# Altium schematic sheet S04_Microcontroller.SchDoc
size A4
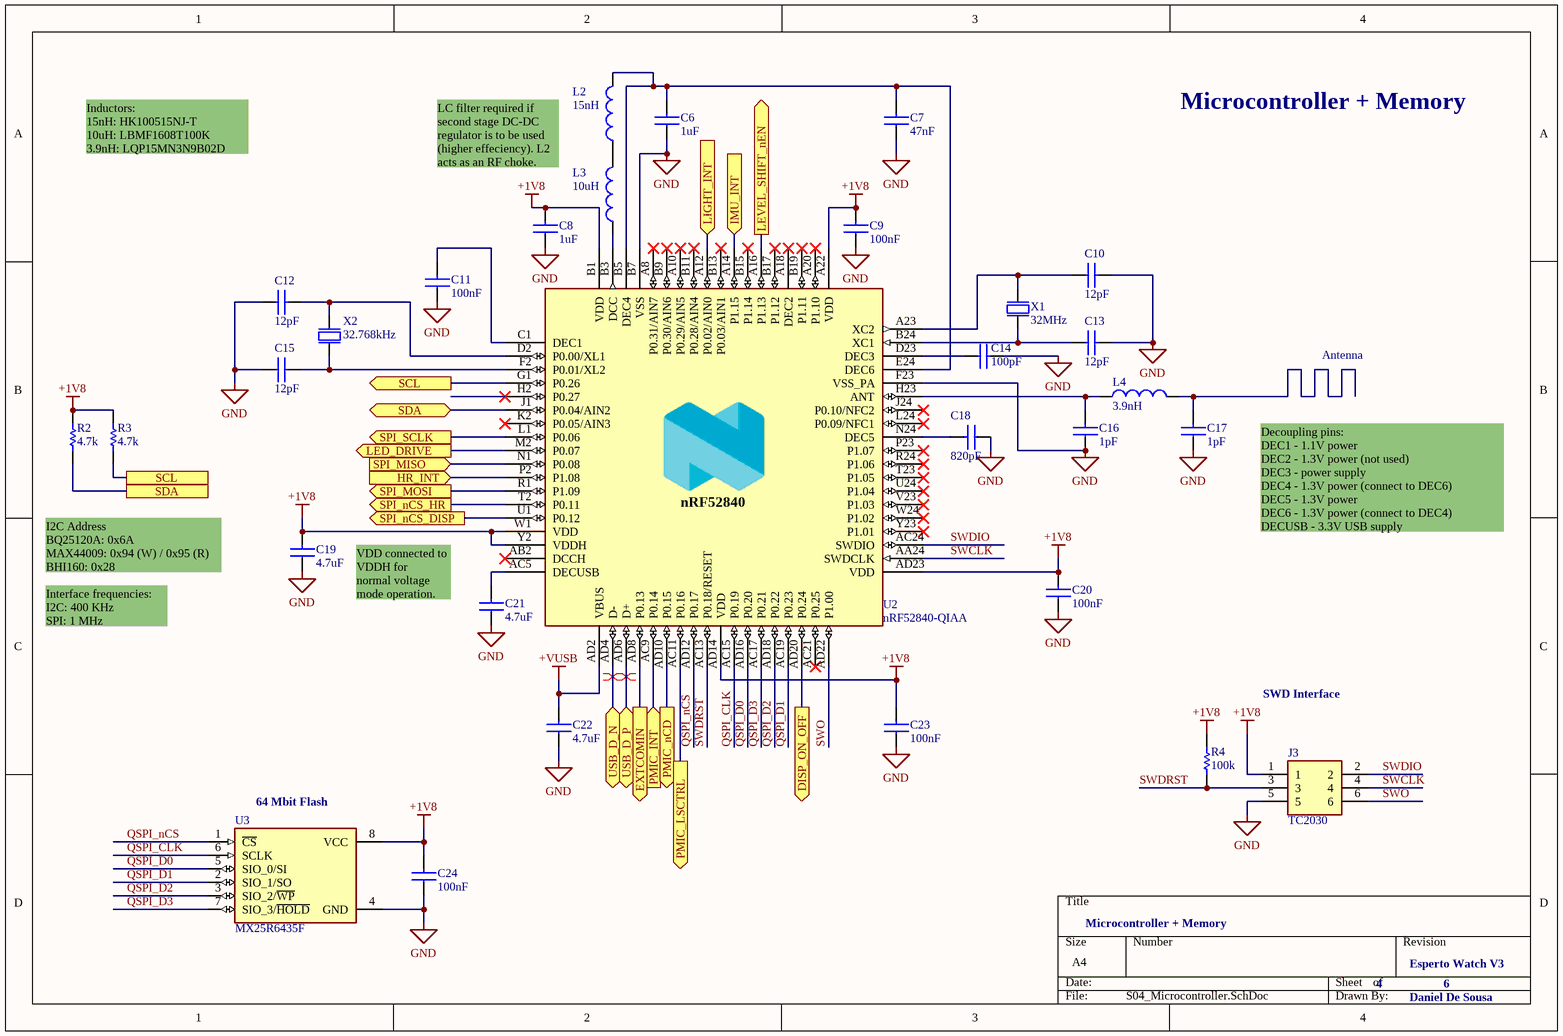
[diagram p0: S04_Microcontroller.SchDoc]

## Parts
C6  1uF  [CC_1005_0402_N]
C7  47nF  [CC_1005_0402_N]
C8  1uF  [CC_1005_0402_N]
C9  100nF  [CC_1005_0402_N]
C10  12pF  [CC_1005_0402_N]
C11  100nF  [CC_1005_0402_N]
C12  12pF  [CC_1005_0402_N]
C13  12pF  [CC_1005_0402_N]
C14  100pF  [CC_1005_0402_N]
C15  12pF  [CC_1005_0402_N]
C16  1pF  [CC_1005_0402_N]
C17  1pF  [CC_1005_0402_N]
C18  820pF  [CC_1005_0402_N]
C19  4.7uF  [CC_1005_0402_N]
C20  100nF  [CC_1005_0402_N]
C21  4.7uF  [CC_1005_0402_N]
C22  4.7uF  [CC_1005_0402_N]
C23  100nF  [CC_1005_0402_N]
C24  100nF  [CC_1005_0402_N]
J3  TC2030  [CONN_TC2030]  (no BOM)
L2  15nH  [RC_1005_0402_N]
L3  10uH  [IND_1608_0603_N]
L4  3.9nH  [RC_1005_0402_N]
R2  4.7k  [RC_1005_0402_N]
R3  4.7k  [RC_1005_0402_N]
R4  100k  [RC_1005_0402_N]
U2  nRF52840-QIAA  [nRF52840]
U3  MX25R6435F  [MX25R6435FZNIL0]
X1  32MHz  [XTAL_32M]
X2  32.768kHz  [XTAL_32K768]

## Ports
DISP_ON_OFF (out), EXTCOMIN (out), HR_INT (in), IMU_INT (in), LED_DRIVE (out), LEVEL_SHIFT_nEN (out), LIGHT_INT (in), PMIC_INT (in), PMIC_LSCTRL (out), PMIC_nCD (out), SCL, SCL (out), SDA, SDA (bidir), SPI_MISO (in), SPI_MOSI (out), SPI_nCS_DISP (out), SPI_nCS_HR (out), SPI_SCLK (out), USB_D_N (bidir), USB_D_P (bidir)

## Nets
+1V8: C8.2 C9.2 C19.2 C20.2 C23.2 C24.2 J3.1 R2.2 R3.2 R4.2 U2.A22(VDD) U2.AD14(VDD) U2.AD23(VDD) U2.B1(VDD) U2.W1(VDD) U2.Y2(VDDH) U3.8(VCC)
+VUSB: C22.2 U2.AD2(VBUS)
GND: C6.1 C7.1 C8.1 C9.1 C10.2 C11.1 C12.1 C13.2 C14.2 C15.1 C16.1 C17.1 C18.1 C19.1 C20.1 C21.1 C22.1 C23.1 C24.1 J3.5 U2.74(GND) U2.B7(VSS) U2.F23(VSS_PA) U3.4(GND) U3.9(GND) X1.2(GND) X1.4(GND)
DISP_ON_OFF: U2.AD20(P0.24) ; port DISP_ON_OFF
EXTCOMIN: U2.AD8(P0.13) ; port EXTCOMIN
HR_INT: U2.P2(P1.08) ; port HR_INT
IMU_INT: U2.A14(P1.15) ; port IMU_INT
LED_DRIVE: U2.M2(P0.07) ; port LED_DRIVE
LEVEL_SHIFT_nEN: U2.A16(P1.13) ; port LEVEL_SHIFT_nEN
LIGHT_INT: U2.A12(P0.02/AIN0) ; port LIGHT_INT
PMIC_INT: U2.AC9(P0.14) ; port PMIC_INT
PMIC_LSCTRL: U2.AC11(P0.16) ; port PMIC_LSCTRL
PMIC_nCD: U2.AD10(P0.15) ; port PMIC_nCD
QSPI_CLK: U2.AC15(P0.19) U3.6(SCLK)
QSPI_D0: U2.AD16(P0.20) U3.5(SIO_0/SI)
QSPI_D1: U2.AC19(P0.23) U3.2(SIO_1/SO)
QSPI_D2: U2.AD18(P0.22) U3.3(SIO_2/~{WP})
QSPI_D3: U2.AC17(P0.21) U3.7(SIO_3/~{HOLD})
QSPI_nCS: U2.AD12(P0.17) U3.1(~{CS})
SCL: R3.1 U2.G1(P0.26) ; port SCL
SDA: R2.1 U2.J1(P0.04/AIN2) ; port SDA
SPI_MISO: U2.N1(P0.08) ; port SPI_MISO
SPI_MOSI: U2.R1(P1.09) ; port SPI_MOSI
SPI_nCS_DISP: U2.U1(P0.12) ; port SPI_nCS_DISP
SPI_nCS_HR: U2.T2(P0.11) ; port SPI_nCS_HR
SPI_SCLK: U2.L1(P0.06) ; port SPI_SCLK
SWCLK: J3.4 U2.AA24(SWDCLK)
SWDIO: J3.2 U2.AC24(SWDIO)
SWDRST: J3.3 R4.1 U2.AC13(P0.18/RESET)
SWO: J3.6 U2.AD22(P1.00)
USB_D_N: U2.AD4(D-) ; port USB_D_N
USB_D_P: U2.AD6(D+) ; port USB_D_P
NetC6_2: C6.2 C7.2 L2.2 U2.B5(DEC4) U2.E24(DEC6)
NetC10_1: C10.1 U2.A23(XC2) X1.3(out)
NetC11_2: C11.2 U2.C1(DEC1)
NetC12_2: C12.2 U2.D2(P0.00/XL1) X2.2(out)
NetC13_1: C13.1 U2.B24(XC1) X1.1(inp)
NetC14_1: C14.1 U2.D23(DEC3)
NetC15_2: C15.2 U2.F2(P0.01/XL2) X2.1(inp)
NetC16_2: C16.2 L4.1 U2.H23(ANT)
NetC17_2: C17.2 L4.2
NetC18_2: C18.2 U2.N24(DEC5)
NetC21_2: C21.2 U2.AC5(DECUSB)
NetL2_1: L2.1 L3.2
NetL3_1: L3.1 U2.B3(DCC)

Not connected (* = marked no-connect by the designer): U2 A8(P0.31/AIN7)* A10(P0.29/AIN5)* A18(DEC2)* A20(P1.10)* AB2(DCCH)* AC21(P0.25)* B9(P0.30/AIN6)* B11(P0.28/AIN4)* B13(P0.03/AIN1)* B15(P1.14)* B17(P1.12)* B19(P1.11)* H2(P0.27)* J24(P0.10/NFC2)* K2(P0.05/AIN3)* L24(P0.09/NFC1)* P23(P1.07)* R24(P1.06)* T23(P1.05)* U24(P1.04)* V23(P1.03)* W24(P1.02)* Y23(P1.01)*

## Layout directives
differential pair: USB_D_N, USB_D_P

## Notes on the sheet
- Microcontroller + Memory
- Inductors:
  15nH: HK100515NJ-T
  10uH: LBMF1608T100K
  3.9nH: LQP15MN3N9B02D
- LC filter required if second stage DC-DC regulator is to be used (higher effeciency). L2 acts as an RF choke.
- Antenna
- I2C Address
  BQ25120A: 0x6A
  MAX44009: 0x94 (W) / 0x95 (R)
  BHI160: 0x28
- Decoupling pins:
  DEC1 - 1.1V power
  DEC2 - 1.3V power (not used)
  DEC3 - power supply
  DEC4 - 1.3V power (connect to DEC6)
  DEC5 - 1.3V power
  DEC6 - 1.3V power (connect to DEC4)
  DECUSB - 3.3V USB supply
- Interface frequencies:
  I2C: 400 KHz
  SPI: 1 MHz
- VDD connected to VDDH for
  normal voltage mode operation.
  Disables first regulator stage
- SWD Interface
- (near U3) 64 Mbit Flash
- 4
- Esperto Watch V3
- 6
- Daniel De Sousa

## Library data of the parts
C6-C24 = Capacitor
  C6 C8: VALUE: 1uF
  C7: VALUE: 47nF
  C9 C11 C20 C23 C24: VALUE: 100nF
  C10 C12 C13 C15: VALUE: 12pF
  C14: VALUE: 100pF
  C16 C17: VALUE: 1pF
  C18: VALUE: 820pF
  C19 C21 C22: VALUE: 4.7uF
L2 L4 = Inductor_0402: Inductor
  L2: VALUE: 15nH
  L4: VALUE: 3.9nH
L3 = Inductor_0603: Inductor; VALUE: 10uH
R2-R4 = Resistor
  R2 R3: Value: 4.7k
  R4: Value: 100k
U2 = nRF52840: Multi-protocol Bluetooth Low Energy, IEEE 802.15.4, ANT and 2.4GHz proprietary system-on-chip; Part Number: nRF52840-QIAAC0; Manufacturer: Nordic Semiconductor; Artikkelnr Noca: N.A.; LatestRevisionDate: 2017-12-06; Pin Count: 73; Publisher: Nordic Semiconductor; Published: 2017-08-21; Value: nRF52840-QIAA; Note: *; Footprint Doc: AQFN-73; Manufacturer Part Number: nRF52840-QIAAC0; Supplier: Nordic Semiconductor; Supplier part number: nRF52840-QIAAC0; 2nd source Supplier: *; 2nd source part number: *; Artikkelnr Simpro: N.A.; Part number IPS: N.A.; ComponentLink1Description: Datasheet; ComponentLink1URL: *; ComponentLink2Description: Supplier link; ComponentLink2URL: *; HelpURL: *
U3 = MX25R6435FZNIL0: Ultra low power, 64M-bit, serial multi I/O flash memory; Manufacturer: Macronix; Artikkelnr Noca: 15020015; Artikkelnr Simpro: N.A.; Part Number: MX25R6435FZNIL0; Manufacturer Part Number: MX25R6435FZNIL0; Datasheet: http://www.macronix.com/Lists/Datasheet/Attachments/3881/MX25R6435F,%20Wide%20Range,%2064Mb,%20v1.3.pdf; Footprint Doc: WSON-8; LatestRevisionDate: 2016-06-29; Pin Count: 8; Publisher: Nordic Semiconductor; Published: 2016-06-29; Value: MX25R6435F; Note: *; Supplier: Future; Supplier part number: MX25R6435FZNIL0; 2nd source Supplier: Arrow; 2nd source part number: MX25R6435FZNIL0
X1 = XTAL_32M: XTAL SMD 2016, 32MHz, Cl=8pF, Tol: ±10ppm, Stab: ±10ppm; Part Number: XTAL_SMD2016_32MHz_8pF_Murata; Manufacturer: Murata; Manufacturer Part Number: XRCGB32M000F1H01R0; Part number IPS: 80000001424; Note: XTAL SMD 32.000MHz; Artikkelnr Noca: N.A.; LatestRevisionDate: 2017-11-09; Pin Count: 4; Publisher: Nordic Semiconductor; Published: 2016-10-26; Value: 32MHz; Supplier: *; Supplier part number: *; 2nd source Supplier: *; 2nd source part number: *; Footprint Doc: XTAL_2016; Artikkelnr Simpro: N.A.; ComponentLink1Description: Datasheet; ComponentLink1URL: *; ComponentLink2Description: Supplier link; ComponentLink2URL: *; HelpURL: http://www.murata.com/en-global/products/productdetail.aspx?cate=cgsubCrystalUnits&partno=XRCGB32M000F1H01R0
X2 = XTAL_32K768: XTAL SMD 2012, 32.768kHz, 9pF, ±20ppm; Part Number: XTAL_SMD2012_32.768kHz_9pF_Seiko; Manufacturer: Seiko; Manufacturer Part Number: SC20S-9.0PF20PPM; Part number IPS: 80000001425; Note: XTAL SMD 32.768kHz; Artikkelnr Noca: N.A.; LatestRevisionDate: 2017-11-09; Pin Count: 2; Publisher: Nordic Semiconductor; Published: 2015-10-15; Value: 32.768kHz; Supplier: *; Supplier part number: *; 2nd source Supplier: *; 2nd source part number: *; Footprint Doc: XTAL_2012; Artikkelnr Simpro: N.A.; ComponentLink1Description: Datasheet; ComponentLink1URL: *; ComponentLink2Description: Supplier link; ComponentLink2URL: *; HelpURL: http://www.sii.co.jp/en/quartz/files/2013/03/file_PRODUCT_MASTER_50811_GRAPHIC03.pdf